# EAGLE design tigerV3s0-2 (EAGLE 9.6.2)
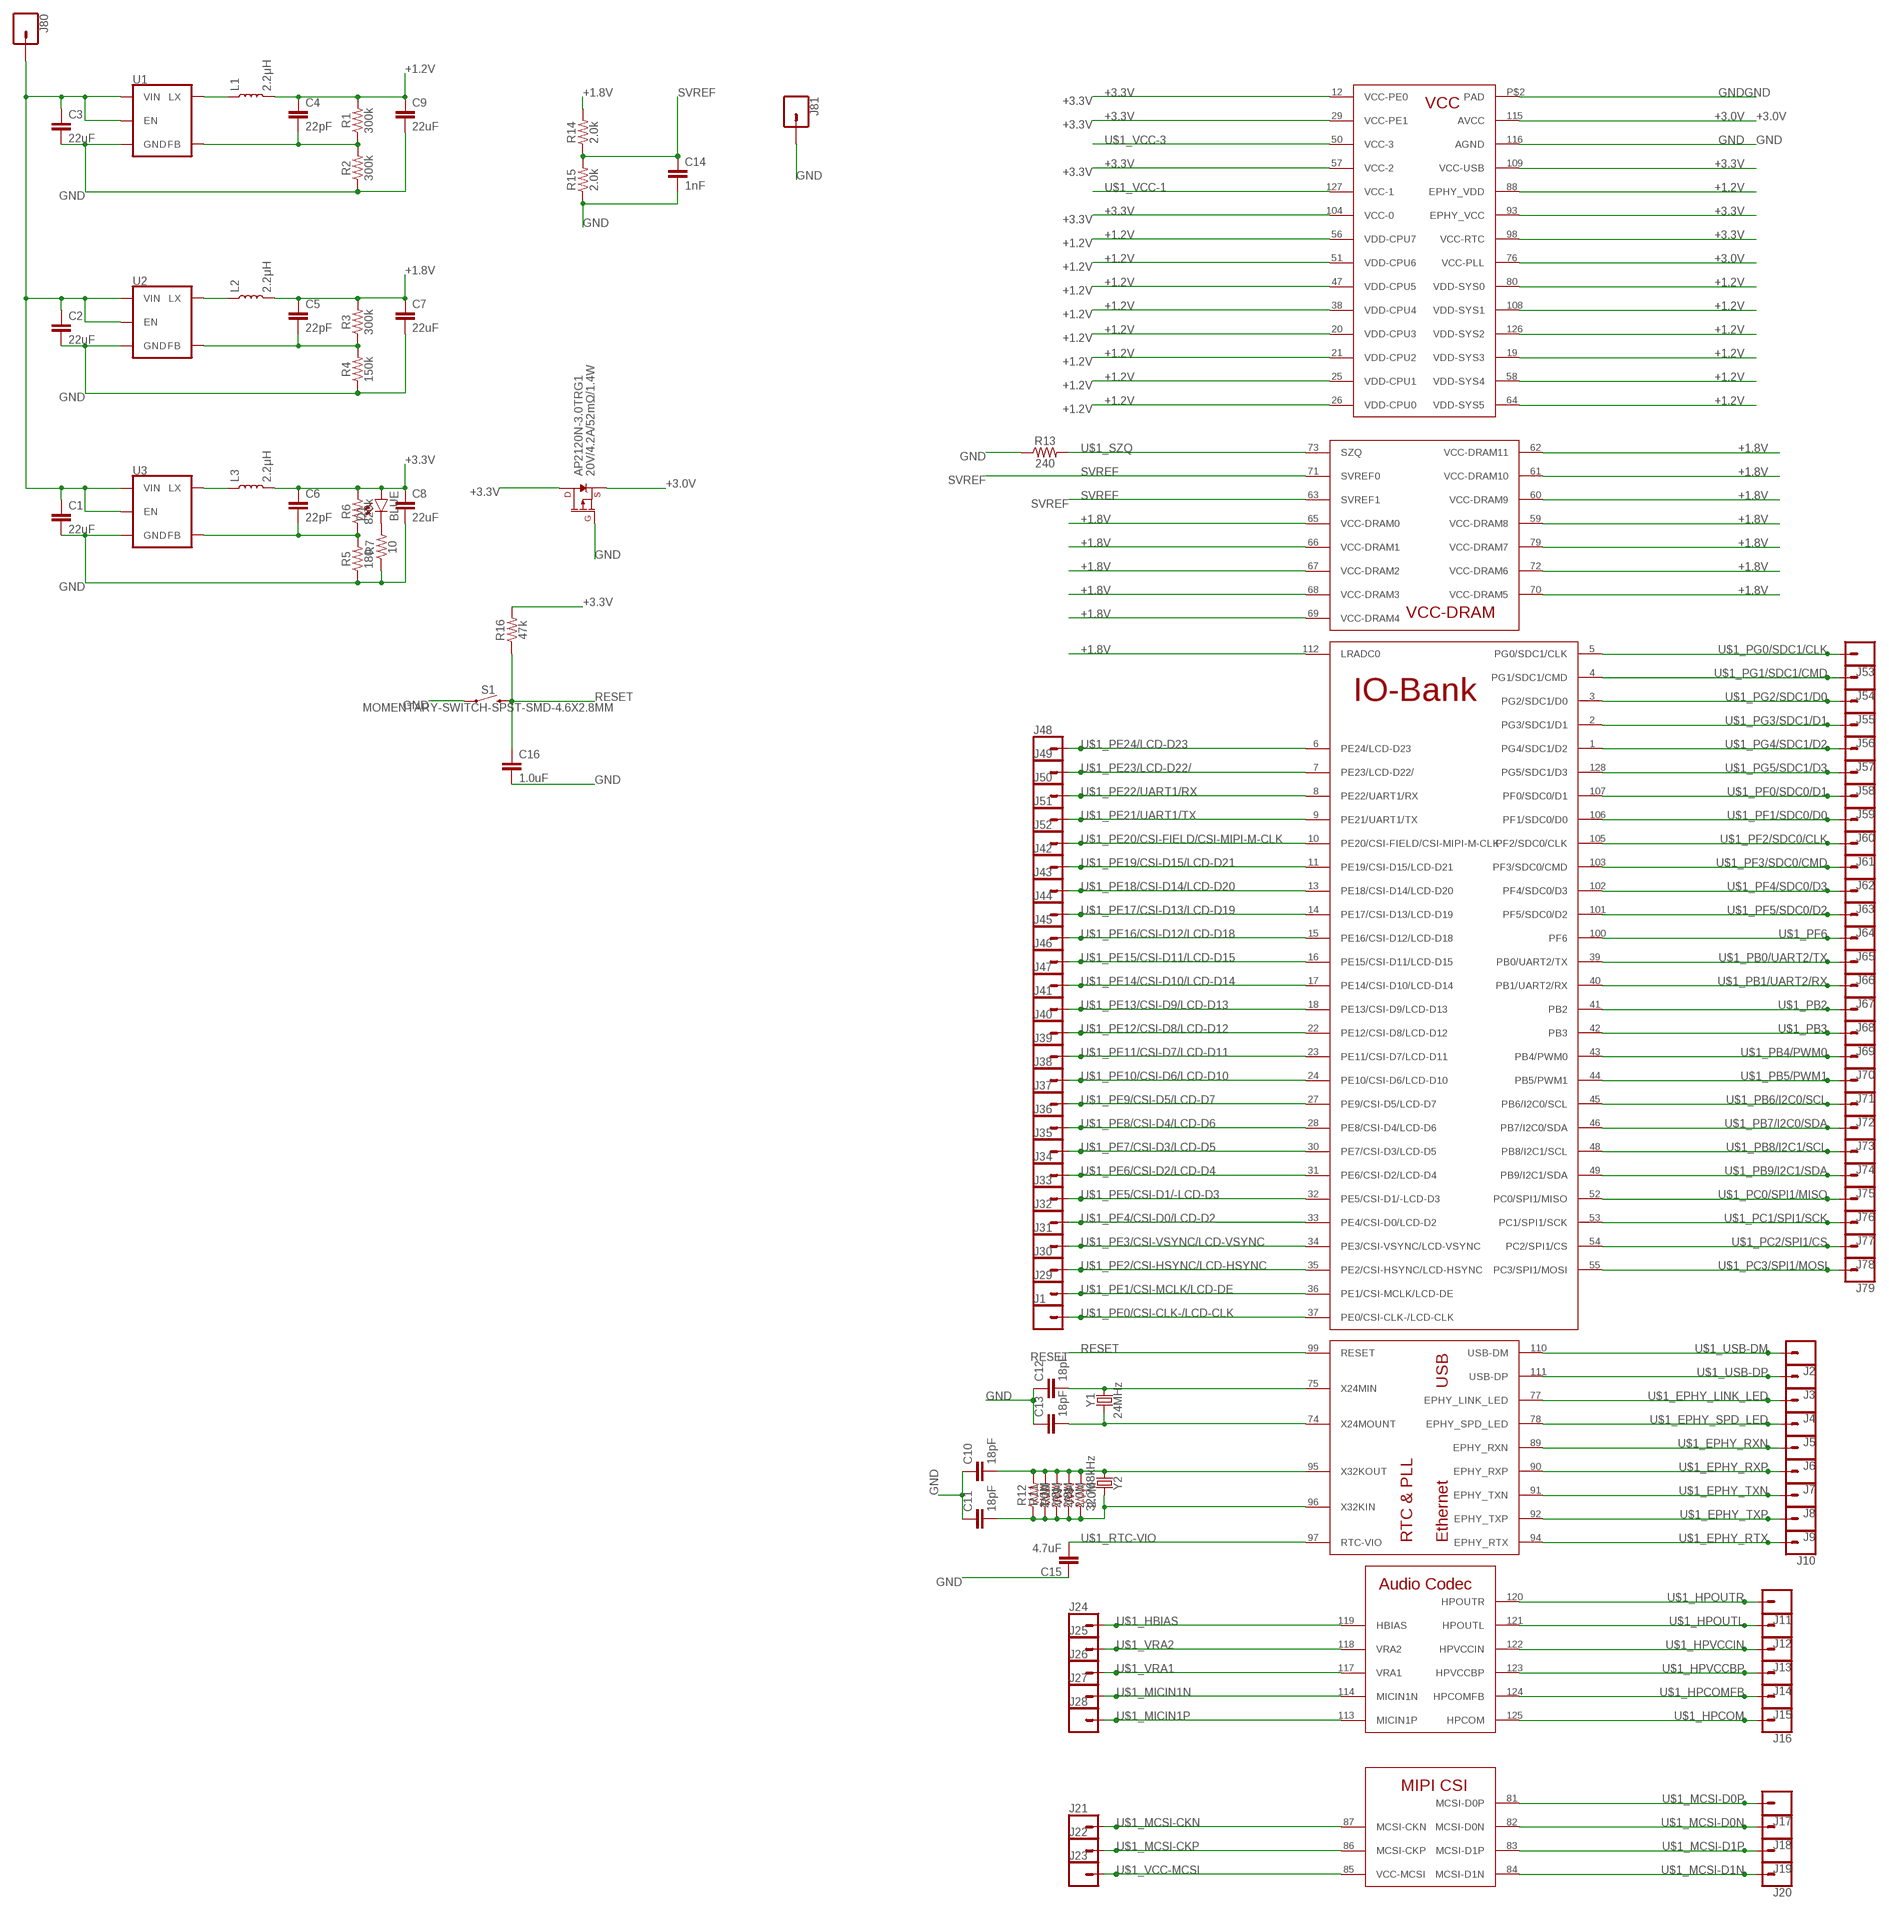
[diagram p0: schematic, sheet 1]

## Parts
AP2120N-3.0TRG1  20V/4.2A/52mΩ/1.4W  MOSFET_PCH-DMG2305UX-7  [SOT23-3]
C1  22uF  22UF-0805-6.3V-20%  [0805]
C2  22uF  22UF-0805-6.3V-20%  [0805]
C3  22uF  22UF-0805-6.3V-20%  [0805]
C4  22pF  22PF-0603-50V-5%  [0603]
C5  22pF  22PF-0603-50V-5%  [0603]
C6  22pF  22PF-0603-50V-5%  [0603]
C7  22uF  22UF-0805-6.3V-20%  [0805]
C8  22uF  22UF-0805-6.3V-20%  [0805]
C9  22uF  22UF-0805-6.3V-20%  [0805]
C10  18pF  18PF-0603-50V-5%  [0603]
C11  18pF  18PF-0603-50V-5%  [0603]
C12  18pF  18PF-0603-50V-5%  [0603]
C13  18pF  18PF-0603-50V-5%  [0603]
C14  1nF  1.0NF/1000PF-0603-50V-10%  [0603]
C15  4.7uF  4.7UF-0603-6.3V-(10%)  [0603]
C16  1.0uF  1.0UF-0603-16V-10%  [0603]
D1  BLUE  LED-BLUE0603  [LED-0603]
J1  CONN_01  [1X01]
J2  CONN_01  [1X01]
J3  CONN_01  [1X01]
J4  CONN_01  [1X01]
J5  CONN_01  [1X01]
J6  CONN_01  [1X01]
J7  CONN_01  [1X01]
J8  CONN_01  [1X01]
J9  CONN_01  [1X01]
J10  CONN_01  [1X01]
J11  CONN_01  [1X01]
J12  CONN_01  [1X01]
J13  CONN_01  [1X01]
J14  CONN_01  [1X01]
J15  CONN_01  [1X01]
J16  CONN_01  [1X01]
J17  CONN_01  [1X01]
J18  CONN_01  [1X01]
J19  CONN_01  [1X01]
J20  CONN_01  [1X01]
J21  CONN_01  [1X01]
J22  CONN_01  [1X01]
J23  CONN_01  [1X01]
J24  CONN_01  [1X01]
J25  CONN_01  [1X01]
J26  CONN_01  [1X01]
J27  CONN_01  [1X01]
J28  CONN_01  [1X01]
J29  CONN_01  [1X01]
J30  CONN_01  [1X01]
J31  CONN_01  [1X01]
J32  CONN_01  [1X01]
J33  CONN_01  [1X01]
J34  CONN_01  [1X01]
J35  CONN_01  [1X01]
J36  CONN_01  [1X01]
J37  CONN_01  [1X01]
J38  CONN_01  [1X01]
J39  CONN_01  [1X01]
J40  CONN_01  [1X01]
J41  CONN_01  [1X01]
J42  CONN_01  [1X01]
J43  CONN_01  [1X01]
J44  CONN_01  [1X01]
J45  CONN_01  [1X01]
J46  CONN_01  [1X01]
J47  CONN_01  [1X01]
J48  CONN_01  [1X01]
J49  CONN_01  [1X01]
J50  CONN_01  [1X01]
J51  CONN_01  [1X01]
J52  CONN_01  [1X01]
J53  CONN_01  [1X01]
J54  CONN_01  [1X01]
J55  CONN_01  [1X01]
J56  CONN_01  [1X01]
J57  CONN_01  [1X01]
J58  CONN_01  [1X01]
J59  CONN_01  [1X01]
J60  CONN_01  [1X01]
J61  CONN_01  [1X01]
J62  CONN_01  [1X01]
J63  CONN_01  [1X01]
J64  CONN_01  [1X01]
J65  CONN_01  [1X01]
J66  CONN_01  [1X01]
J67  CONN_01  [1X01]
J68  CONN_01  [1X01]
J69  CONN_01  [1X01]
J70  CONN_01  [1X01]
J71  CONN_01  [1X01]
J72  CONN_01  [1X01]
J73  CONN_01  [1X01]
J74  CONN_01  [1X01]
J75  CONN_01  [1X01]
J76  CONN_01  [1X01]
J77  CONN_01  [1X01]
J78  CONN_01  [1X01]
J79  CONN_01  [1X01]
J80  CONN_01  [1X01]
J81  CONN_01  [1X01]
L1  2.2μH  2.2μH-0805_WIDE-2.2μH-1.7A-0.14OHM  [0805-WIDE]
L2  2.2μH  2.2μH-0805_WIDE-2.2μH-1.7A-0.14OHM  [0805-WIDE]
L3  2.2μH  2.2μH-0805_WIDE-2.2μH-1.7A-0.14OHM  [0805-WIDE]
R1  300k  300KOHM-0603-1/10W-1%  [0603]
R2  300k  300KOHM-0603-1/10W-1%  [0603]
R3  300k  300KOHM-0603-1/10W-1%  [0603]
R4  150k  150KOHM-0603-1/10W-1%  [0603]
R5  180  180OHM-0603-1/10W-1%  [0603]
R6  820k  820KOHM-0603-1/10W-1%  [0603]
R7  10  10OHM-0603-1/10W-1%  [0603]
R8  2.0M  2MOHMS-0603-1/10W-1%  [0603]
R9  2.0M  2MOHMS-0603-1/10W-1%  [0603]
R10  2.0M  2MOHMS-0603-1/10W-1%  [0603]
R11  2.0M  2MOHMS-0603-1/10W-1%  [0603]
R12  2.0M  2MOHMS-0603-1/10W-1%  [0603]
R13  240  240OHM-0603-1/10W-1%  [0603]
R14  2.0k  2.0KOHM-0603-1/10W-5%  [0603]
R15  2.0k  2.0KOHM-0603-1/10W-5%  [0603]
R16  47k  47KOHM-0603-1/10W-1%  [0603]
S1  MOMENTARY-SWITCH-SPST-SMD-4.6X2.8MM  [TACTILE_SWITCH_SMD_4.6X2.8MM]
U1  AP3429/A  [SOT23-5]
U2  AP3429/A  [SOT23-5]
U3  AP3429/A  [SOT23-5]
U$1  V3S  [QFP-128]
Y1  24MHz  CRYSTAL-24MHZ-SMD-5.0X3.2MM  [CRYSTAL-SMD-5X3.2-4PAD]
Y2  32.768kHz  CRYSTAL-32.768KHZSMD-3.2X1.5  [CRYSTAL-SMD-3.2X1.5MM]

## Nets
+1.2V: C4.1 C9.1 L1.2 R1.2 U$1.19(VDD-SYS3) U$1.20(VDD-CPU3) U$1.21(VDD-CPU2) U$1.25(VDD-CPU1) U$1.26(VDD-CPU0) U$1.38(VDD-CPU4) U$1.47(VDD-CPU5) U$1.51(VDD-CPU6) U$1.56(VDD-CPU7) U$1.58(VDD-SYS4) U$1.64(VDD-SYS5) U$1.80(VDD-SYS0) U$1.88(EPHY_VDD) U$1.108(VDD-SYS1) U$1.126(VDD-SYS2)
+1.8V: C5.1 C7.1 L2.2 R3.2 R14.2 U$1.59(VCC-DRAM8) U$1.60(VCC-DRAM9) U$1.61(VCC-DRAM10) U$1.62(VCC-DRAM11) U$1.65(VCC-DRAM0) U$1.66(VCC-DRAM1) U$1.67(VCC-DRAM2) U$1.68(VCC-DRAM3) U$1.69(VCC-DRAM4) U$1.70(VCC-DRAM5) U$1.72(VCC-DRAM6) U$1.79(VCC-DRAM7) U$1.112(LRADC0)
+3.0V: AP2120N-3.0TRG1.2(S) U$1.76(VCC-PLL) U$1.115(AVCC)
+3.3V: AP2120N-3.0TRG1.3(D) C6.1 C8.1 D1.A L3.2 R6.2 R16.2 U$1.12(VCC-PE0) U$1.29(VCC-PE1) U$1.57(VCC-2) U$1.93(EPHY_VCC) U$1.98(VCC-RTC) U$1.104(VCC-0) U$1.109(VCC-USB)
+5V: C1.1 C2.1 C3.1 J80.1 U1.1(EN) U1.4(VIN) U2.1(EN) U2.4(VIN) U3.1(EN) U3.4(VIN)
GND: AP2120N-3.0TRG1.1(G) C1.2 C2.2 C3.2 C7.2 C8.2 C9.2 C10.1 C11.1 C12.1 C13.1 C14.2 C15.1 C16.2 J81.1 R2.1 R4.1 R5.1 R7.1 R13.1 R15.1 S1.1 S1.2 U1.2(GND) U2.2(GND) U3.2(GND) U$1.116(AGND) U$1.P$2(PAD)
N$1: L1.1 U1.3(LX)
N$2: D1.C R7.2
N$3: L2.1 U2.3(LX)
N$4: C13.2 U$1.74(X24MOUNT) Y1.1
N$5: L3.1 U3.3(LX)
N$6: C12.2 U$1.75(X24MIN) Y1.3
N$7: C6.2 R5.2 R6.1 U3.5(FB)
N$8: C5.2 R3.1 R4.2 U2.5(FB)
N$9: C4.2 R1.1 R2.2 U1.5(FB)
N$10: C10.2 R8.2 R9.2 R10.2 R11.2 R12.2 U$1.95(X32KOUT) Y2.P$1
N$11: C11.2 R8.1 R9.1 R10.1 R11.1 R12.1 U$1.96(X32KIN) Y2.P$2
RESET: C16.1 R16.1 S1.3 S1.4 U$1.99(RESET)
SVREF: C14.1 R14.1 R15.2 U$1.63(SVREF1) U$1.71(SVREF0)
U$1_EPHY_LINK_LED: J4.1 U$1.77(EPHY_LINK_LED)
U$1_EPHY_RTX: J10.1 U$1.94(EPHY_RTX)
U$1_EPHY_RXN: J6.1 U$1.89(EPHY_RXN)
U$1_EPHY_RXP: J7.1 U$1.90(EPHY_RXP)
U$1_EPHY_SPD_LED: J5.1 U$1.78(EPHY_SPD_LED)
U$1_EPHY_TXN: J8.1 U$1.91(EPHY_TXN)
U$1_EPHY_TXP: J9.1 U$1.92(EPHY_TXP)
U$1_HBIAS: J24.1 U$1.119(HBIAS)
U$1_HPCOM: J16.1 U$1.125(HPCOM)
U$1_HPCOMFB: J15.1 U$1.124(HPCOMFB)
U$1_HPOUTL: J12.1 U$1.121(HPOUTL)
U$1_HPOUTR: J11.1 U$1.120(HPOUTR)
U$1_HPVCCBP: J14.1 U$1.123(HPVCCBP)
U$1_HPVCCIN: J13.1 U$1.122(HPVCCIN)
U$1_MCSI-CKN: J21.1 U$1.87(MCSI-CKN)
U$1_MCSI-CKP: J22.1 U$1.86(MCSI-CKP)
U$1_MCSI-D0N: J18.1 U$1.82(MCSI-D0N)
U$1_MCSI-D0P: J17.1 U$1.81(MCSI-D0P)
U$1_MCSI-D1N: J20.1 U$1.84(MCSI-D1N)
U$1_MCSI-D1P: J19.1 U$1.83(MCSI-D1P)
U$1_MICIN1N: J27.1 U$1.114(MICIN1N)
U$1_MICIN1P: J28.1 U$1.113(MICIN1P)
U$1_PB0/UART2/TX: J66.1 U$1.39(PB0/UART2/TX)
U$1_PB1/UART2/RX: J67.1 U$1.40(PB1/UART2/RX)
U$1_PB2: J68.1 U$1.41(PB2)
U$1_PB3: J69.1 U$1.42(PB3)
U$1_PB4/PWM0: J70.1 U$1.43(PB4/PWM0)
U$1_PB5/PWM1: J71.1 U$1.44(PB5/PWM1)
U$1_PB6/I2C0/SCL: J72.1 U$1.45(PB6/I2C0/SCL)
U$1_PB7/I2C0/SDA: J73.1 U$1.46(PB7/I2C0/SDA)
U$1_PB8/I2C1/SCL: J74.1 U$1.48(PB8/I2C1/SCL)
U$1_PB9/I2C1/SDA: J75.1 U$1.49(PB9/I2C1/SDA)
U$1_PC0/SPI1/MISO: J76.1 U$1.52(PC0/SPI1/MISO)
U$1_PC1/SPI1/SCK: J77.1 U$1.53(PC1/SPI1/SCK)
U$1_PC2/SPI1/CS: J78.1 U$1.54(PC2/SPI1/CS)
U$1_PC3/SPI1/MOSI: J79.1 U$1.55(PC3/SPI1/MOSI)
U$1_PE0/CSI-CLK-/LCD-CLK: J1.1 U$1.37(PE0/CSI-CLK-/LCD-CLK)
U$1_PE1/CSI-MCLK/LCD-DE: J29.1 U$1.36(PE1/CSI-MCLK/LCD-DE)
U$1_PE2/CSI-HSYNC/LCD-HSYNC: J30.1 U$1.35(PE2/CSI-HSYNC/LCD-HSYNC)
U$1_PE3/CSI-VSYNC/LCD-VSYNC: J31.1 U$1.34(PE3/CSI-VSYNC/LCD-VSYNC)
U$1_PE4/CSI-D0/LCD-D2: J32.1 U$1.33(PE4/CSI-D0/LCD-D2)
U$1_PE5/CSI-D1/-LCD-D3: J33.1 U$1.32(PE5/CSI-D1/-LCD-D3)
U$1_PE6/CSI-D2/LCD-D4: J34.1 U$1.31(PE6/CSI-D2/LCD-D4)
U$1_PE7/CSI-D3/LCD-D5: J35.1 U$1.30(PE7/CSI-D3/LCD-D5)
U$1_PE8/CSI-D4/LCD-D6: J36.1 U$1.28(PE8/CSI-D4/LCD-D6)
U$1_PE9/CSI-D5/LCD-D7: J37.1 U$1.27(PE9/CSI-D5/LCD-D7)
U$1_PE10/CSI-D6/LCD-D10: J38.1 U$1.24(PE10/CSI-D6/LCD-D10)
U$1_PE11/CSI-D7/LCD-D11: J39.1 U$1.23(PE11/CSI-D7/LCD-D11)
U$1_PE12/CSI-D8/LCD-D12: J40.1 U$1.22(PE12/CSI-D8/LCD-D12)
U$1_PE13/CSI-D9/LCD-D13: J41.1 U$1.18(PE13/CSI-D9/LCD-D13)
U$1_PE14/CSI-D10/LCD-D14: J47.1 U$1.17(PE14/CSI-D10/LCD-D14)
U$1_PE15/CSI-D11/LCD-D15: J46.1 U$1.16(PE15/CSI-D11/LCD-D15)
U$1_PE16/CSI-D12/LCD-D18: J45.1 U$1.15(PE16/CSI-D12/LCD-D18)
U$1_PE17/CSI-D13/LCD-D19: J44.1 U$1.14(PE17/CSI-D13/LCD-D19)
U$1_PE18/CSI-D14/LCD-D20: J43.1 U$1.13(PE18/CSI-D14/LCD-D20)
U$1_PE19/CSI-D15/LCD-D21: J42.1 U$1.11(PE19/CSI-D15/LCD-D21)
U$1_PE20/CSI-FIELD/CSI-MIPI-M-CLK: J52.1 U$1.10(PE20/CSI-FIELD/CSI-MIPI-M-CLK)
U$1_PE21/UART1/TX: J51.1 U$1.9(PE21/UART1/TX)
U$1_PE22/UART1/RX: J50.1 U$1.8(PE22/UART1/RX)
U$1_PE23/LCD-D22/: J49.1 U$1.7(PE23/LCD-D22/)
U$1_PE24/LCD-D23: J48.1 U$1.6(PE24/LCD-D23)
U$1_PF0/SDC0/D1: J59.1 U$1.107(PF0/SDC0/D1)
U$1_PF1/SDC0/D0: J60.1 U$1.106(PF1/SDC0/D0)
U$1_PF2/SDC0/CLK: J61.1 U$1.105(PF2/SDC0/CLK)
U$1_PF3/SDC0/CMD: J62.1 U$1.103(PF3/SDC0/CMD)
U$1_PF4/SDC0/D3: J63.1 U$1.102(PF4/SDC0/D3)
U$1_PF5/SDC0/D2: J64.1 U$1.101(PF5/SDC0/D2)
U$1_PF6: J65.1 U$1.100(PF6)
U$1_PG0/SDC1/CLK: J53.1 U$1.5(PG0/SDC1/CLK)
U$1_PG1/SDC1/CMD: J54.1 U$1.4(PG1/SDC1/CMD)
U$1_PG2/SDC1/D0: J55.1 U$1.3(PG2/SDC1/D0)
U$1_PG3/SDC1/D1: J56.1 U$1.2(PG3/SDC1/D1)
U$1_PG4/SDC1/D2: J57.1 U$1.1(PG4/SDC1/D2)
U$1_PG5/SDC1/D3: J58.1 U$1.128(PG5/SDC1/D3)
U$1_RTC-VIO: C15.2 U$1.97(RTC-VIO)
U$1_SZQ: R13.2 U$1.73(SZQ)
U$1_USB-DM: J2.1 U$1.110(USB-DM)
U$1_USB-DP: J3.1 U$1.111(USB-DP)
U$1_VCC-1: U$1.127(VCC-1)
U$1_VCC-3: U$1.50(VCC-3)
U$1_VCC-MCSI: J23.1 U$1.85(VCC-MCSI)
U$1_VRA1: J26.1 U$1.117(VRA1)
U$1_VRA2: J25.1 U$1.118(VRA2)

## Library data of the parts
AP2120N-3.0TRG1 = SparkFun-DiscreteSemi:MOSFET_PCH: P-channel MOSFETs Voltage controlled devices that allow control of high current outputs. SparkFun Products: SparkFun ESP32 Thing <https://www.sparkfun.com/products/13907> SparkFun ESP8266 Thing <https://www.sparkfun.com/products/13231> SparkFun Pi Servo HAT V2 <https://www.sparkfun.com/products/15316> DMG2305UX-7 (20V/4.2A/SOT23-3); PROD_ID: TRAN-14388
C1-C3 C7-C9 = SparkFun-Capacitors:22UF: 22µF ceramic capacitors A capacitor is a passive two-terminal electrical component used to store electrical energy temporarily in an electric field.; PROD_ID: CAP-08402
C4-C6 = SparkFun-Capacitors:22PF: 22pF ceramic capacitors A capacitor is a passive two-terminal electrical component used to store electrical energy temporarily in an electric field.; PROD_ID: CAP-07876
C10-C13 = SparkFun-Capacitors:18PF: 18pF ceramic capacitors A capacitor is a passive two-terminal electrical component used to store electrical energy temporarily in an electric field.; PROD_ID: CAP-08267
C14 = SparkFun-Capacitors:1.0NF/1000PF: 1nF/1,000pF ceramic capacitors A capacitor is a passive two-terminal electrical component used to store electrical energy temporarily in an electric field.; PROD_ID: CAP-07886
C15 = SparkFun-Capacitors:4.7UF: 4.7µF ceramic capacitors A capacitor is a passive two-terminal electrical component used to store electrical energy temporarily in an electric field.; PROD_ID: CAP-08280
C16 = SparkFun-Capacitors:1.0UF: 1µF ceramic capacitors A capacitor is a passive two-terminal electrical component used to store electrical energy temporarily in an electric field.; PROD_ID: CAP-00868
D1 = SparkFun-LED:LED-BLUE: Blue SMD LED Used in manufacturing of various products at SparkFun Packages: 0603 - SMD 0603 package [Product Link] <http://www.digikey.com/product-detail/en/SMLE12BC7TT86/511-1589-2-ND/1641808> 1206 - SMD1206 package [Product Link] <http://www.digikey.com/product-detail/en/lite-on-inc/LTST-C150TBKT/160-1643-1-ND/573584> SparkFun Products: ESP8266 Thing-Dev Board <https://www.sparkfun.com/products/13711> RedBoard <https://www.sparkfun.com/products/12757>; PROD_ID: DIO-08575
J1-J81 = SparkFun-Connectors:CONN_01: Single connection point. Often used as Generic Header-pin footprint for 0.1 inch spaced/style header connections On any of the 0.1 inch spaced packages, you can populate with these: Break Away Headers - Straight <https://www.sparkfun.com/products/116> (PRT-00116) Break Away Male Headers - Right Angle <https://www.sparkfun.com/products/553> (PRT-00553) Female Headers <https://www.sparkfun.com/products/115> (PRT-00115) Break Away Headers - Machine Pin <https://www.sparkfun.com/products/117> (PRT-00117) Break Away Female Headers - Swiss Machine Pin <https://www.sparkfun.com/products/743> (PRT-00743) This device is also useful as a general connection point to wire up your design to another part of your project. Our various solder wires solder well into these plated through hole pads. Hook-Up Wire - Assortment (Stranded, 22 AWG) <https://www.sparkfun.com/products/11375> (PRT-11375) Hook-Up Wire - Assortment (Solid Core, 22 AWG) <https://www.sparkfun.com/products/11367> (PRT-11367) View the entire wire category on our website here <https://www.sparkfun.com/categories/141> Special notes: SMTSO-256-ET is a "flush mount" nut for a 4-40 screw. We mostly use this on specialty testbeds; it is a nice way to connect hardware to your PCB at an adjustable hieght. Also note, the SNAP packages are for using a snappable style connector. We sell a baggie of snaps and they are also used on two LilyPad designs: Snap Assortment - 30 pack (male and female) <https://www.sparkfun.com/products/11347> (DEV-11347) LilyPad Arduino SimpleSnap <https://www.sparkfun.com/products/10941> (DEV-10941) LilyPad SimpleSnap Protoboard <https://www.sparkfun.com/products/10940> (DEV-10940)
L1-L3 = SparkFun-Coils:2.2μH: 2.2μH Inductor Resist changes in electrical current. Basically a coil of wire. SparkFun Products: SparkFun Edge - HX711 <https://www.sparkfun.com/products/15170>; PROD_ID: NDUC-14234
R1-R3 = SparkFun-Resistors:300KOHM: 300kΩ resistor A resistor is a passive two-terminal electrical component that implements electrical resistance as a circuit element. Resistors act to reduce current flow, and, at the same time, act to lower voltage levels within circuits. - Wikipedia; PROD_ID: RES-10809
R4 = SparkFun-Resistors:150KOHM: 150kΩ resistor A resistor is a passive two-terminal electrical component that implements electrical resistance as a circuit element. Resistors act to reduce current flow, and, at the same time, act to lower voltage levels within circuits. - Wikipedia; PROD_ID: RES-09117
R5 = SparkFun-Resistors:180OHM: 180Ω resistor A resistor is a passive two-terminal electrical component that implements electrical resistance as a circuit element. Resistors act to reduce current flow, and, at the same time, act to lower voltage levels within circuits. - Wikipedia; PROD_ID: RES-08788
R6 = SparkFun-Resistors:820KOHM: 820kΩ resistor A resistor is a passive two-terminal electrical component that implements electrical resistance as a circuit element. Resistors act to reduce current flow, and, at the same time, act to lower voltage levels within circuits. - Wikipedia; PROD_ID: RES-13247
R7 = SparkFun-Resistors:10OHM: 10Ω resistor A resistor is a passive two-terminal electrical component that implements electrical resistance as a circuit element. Resistors act to reduce current flow, and, at the same time, act to lower voltage levels within circuits. - Wikipedia; PROD_ID: RES-12581
R8-R12 = SparkFun-Resistors:2MOHMS: 2MΩ resistor A resistor is a passive two-terminal electrical component that implements electrical resistance as a circuit element. Resistors act to reduce current flow, and, at the same time, act to lower voltage levels within circuits. - Wikipedia; PROD_ID: RES-10054
R13 = SparkFun-Resistors:240OHM: 240Ω resistor A resistor is a passive two-terminal electrical component that implements electrical resistance as a circuit element. Resistors act to reduce current flow, and, at the same time, act to lower voltage levels within circuits. - Wikipedia; PROD_ID: RES-07849
R14 R15 = SparkFun-Resistors:2.0KOHM: 2kΩ resistor A resistor is a passive two-terminal electrical component that implements electrical resistance as a circuit element. Resistors act to reduce current flow, and, at the same time, act to lower voltage levels within circuits. - Wikipedia; PROD_ID: RES-08296
R16 = SparkFun-Resistors:47KOHM: 47kΩ resistor A resistor is a passive two-terminal electrical component that implements electrical resistance as a circuit element. Resistors act to reduce current flow, and, at the same time, act to lower voltage levels within circuits. - Wikipedia; PROD_ID: RES-07871
S1 = SparkFun-Switches:MOMENTARY-SWITCH-SPST: Momentary Switch (Pushbutton) - SPST Normally-open (NO) SPST momentary switches (buttons, pushbuttons). Variants PTH-12MM - 12mm square, through-hole Momentary Pushbutton Switch - 12mm Square <https://www.sparkfun.com/products/9190> (COM-09190) PTH-6.0MM, PTH-6.0MM-KIT - 6.0mm square, through-hole Mini Pushbutton Switch <https://www.sparkfun.com/products/97> (COM-00097) KIT package intended for soldering kit's - only one side of pads' copper is exposed. PTH-RIGHT-ANGLE-KIT - Right-angle, through-hole Right Angle Tactile Button <https://www.sparkfun.com/products/10791> - Used on SparkFun BigTime Watch Kit <https://www.sparkfun.com/products/11734> SMD-12MM - 12mm square, surface-mount Tactile Button - SMD (12mm) <https://www.sparkfun.com/products/12993> (COM-12993) Used on SparkFun PicoBoard <https://www.sparkfun.com/products/11888> SMD-4.5MM - 4.5mm Square Trackball Switch Used on SparkFun Blackberry Trackballer Breakout <https://www.sparkfun.com/products/13169> SMD-4.6MMX2.8MM - 4.60mm x 2.80mm, surface mount Used on SparkFun SAMD21 Mini Breakout <https://www.sparkfun.com/products/13664> SMD-5.2MM, SMD-5.2-REDUNDANT - 5.2mm square, surface-mount Mini Pushbutton Switch - SMD <https://www.sparkfun.com/products/8720> (COM-08720) Used on Arduino Pro Mini <https://www.sparkfun.com/products/11114> REDUNDANT package connects both switch circuits together SMD-6.0X3.5MM - 6.0 x 3.5mm, surface mount Momentary Reset Switch SMD <https://www.sparkfun.com/products/8229> (COM-08229) SMD-6.2MM-TALL - 6.2mm square, surface mount Tactile Button - SMD (6mm) <https://www.sparkfun.com/products/12992> Used on SparkFun Digital Sandbox <https://www.sparkfun.com/products/12651> SMD-RIGHT-ANGLE - Right-angle, surface mount Used on SparkFun Block for Intel® Edison - Arduino <https://www.sparkfun.com/products/13036>; PROD_ID: SWCH-13065
U1-U3 = SparkFun-IC-Power:AP3429/A: AP3429A DC adjustable buck up to 2A output. Auto cut-off at 2.7V makes this a good option for LiPo and other battery powered circuits.; PROD_ID: IC-14465
U$1 = allwinnerV3s:V3S
Y1 = SparkFun-Clocks:CRYSTAL-24MHZ: 24MHz Crystal Datasheet <http://www.sparkfun.com/datasheets/Components/AT-SMD-5x3.pdf> Frequency: 24MHz Frequency Tolerance: ±20ppm Load Capacitance: 12pF SparkFun Products: USB Bit Whacker <https://www.sparkfun.com/products/762>; PROD_ID: XTAL-08298; SF_ID: COM-08581
Y2 = SparkFun-Clocks:CRYSTAL-32.768KHZ: 32.768kHz Crystal Frequency: 32.768kHz Frequency Stability: ±20ppm Load Capacitance: 12.5pF (PTH-2X6 & SMD-3.2X1.5), 6pF (SMD-2X6) SparkFun Products: SparkFun BigTime Watch Kit <https://www.sparkfun.com/products/11734> SparkFun nRF52832 Breakout <https://www.sparkfun.com/products/13990> SparkFun Real Time Clock Module <https://www.sparkfun.com/products/12708>; PROD_ID: XTAL-13062

## Board
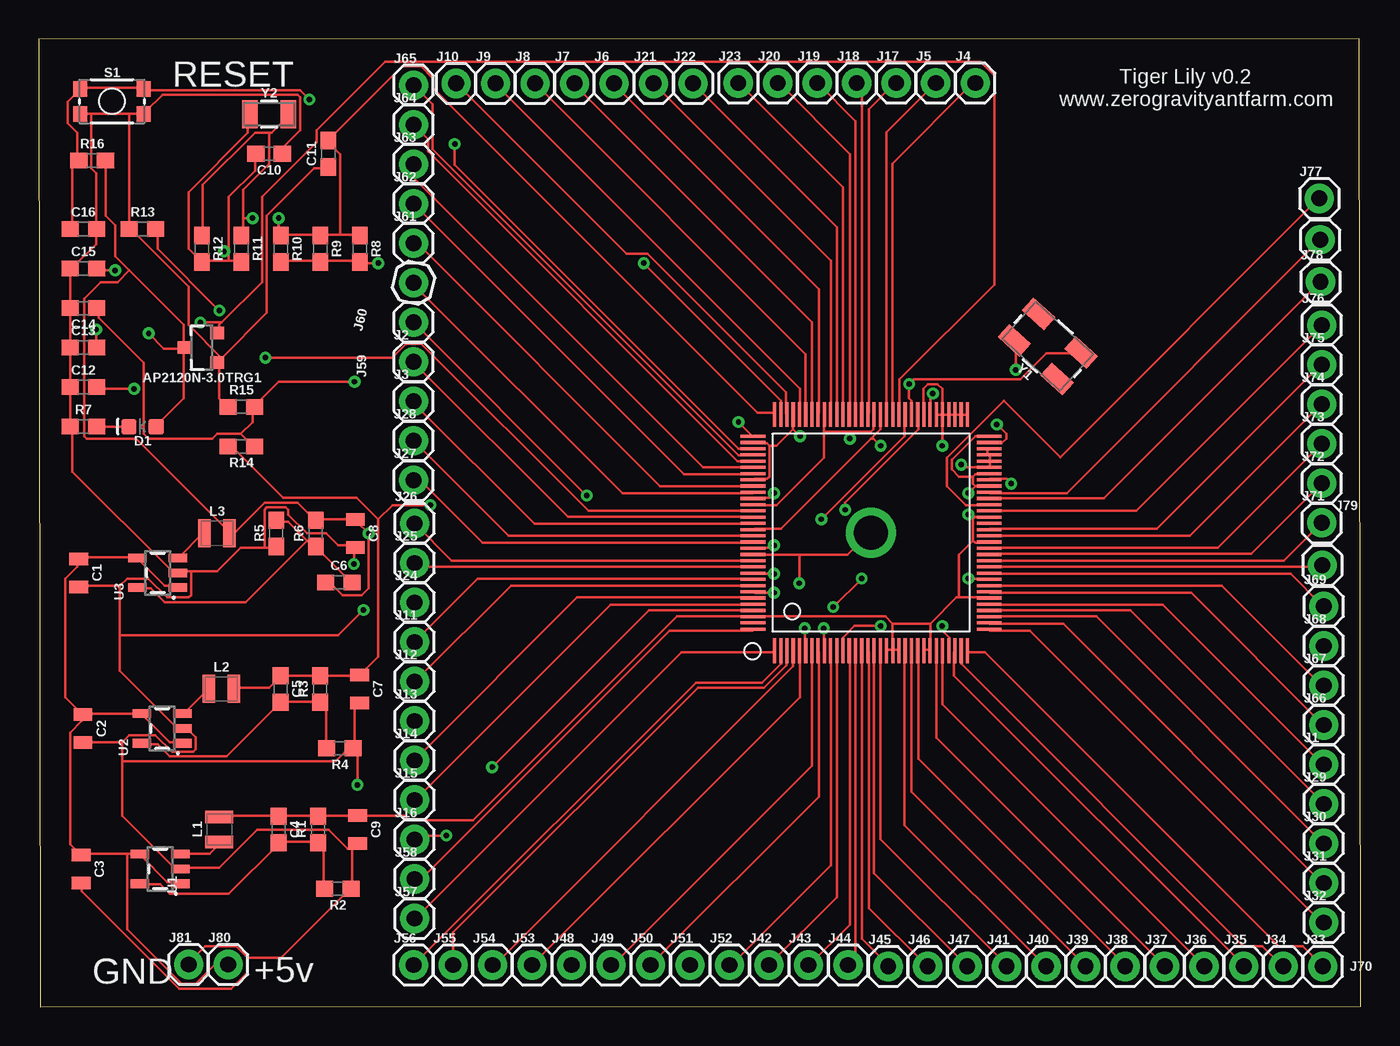
[diagram p1: board, top side]
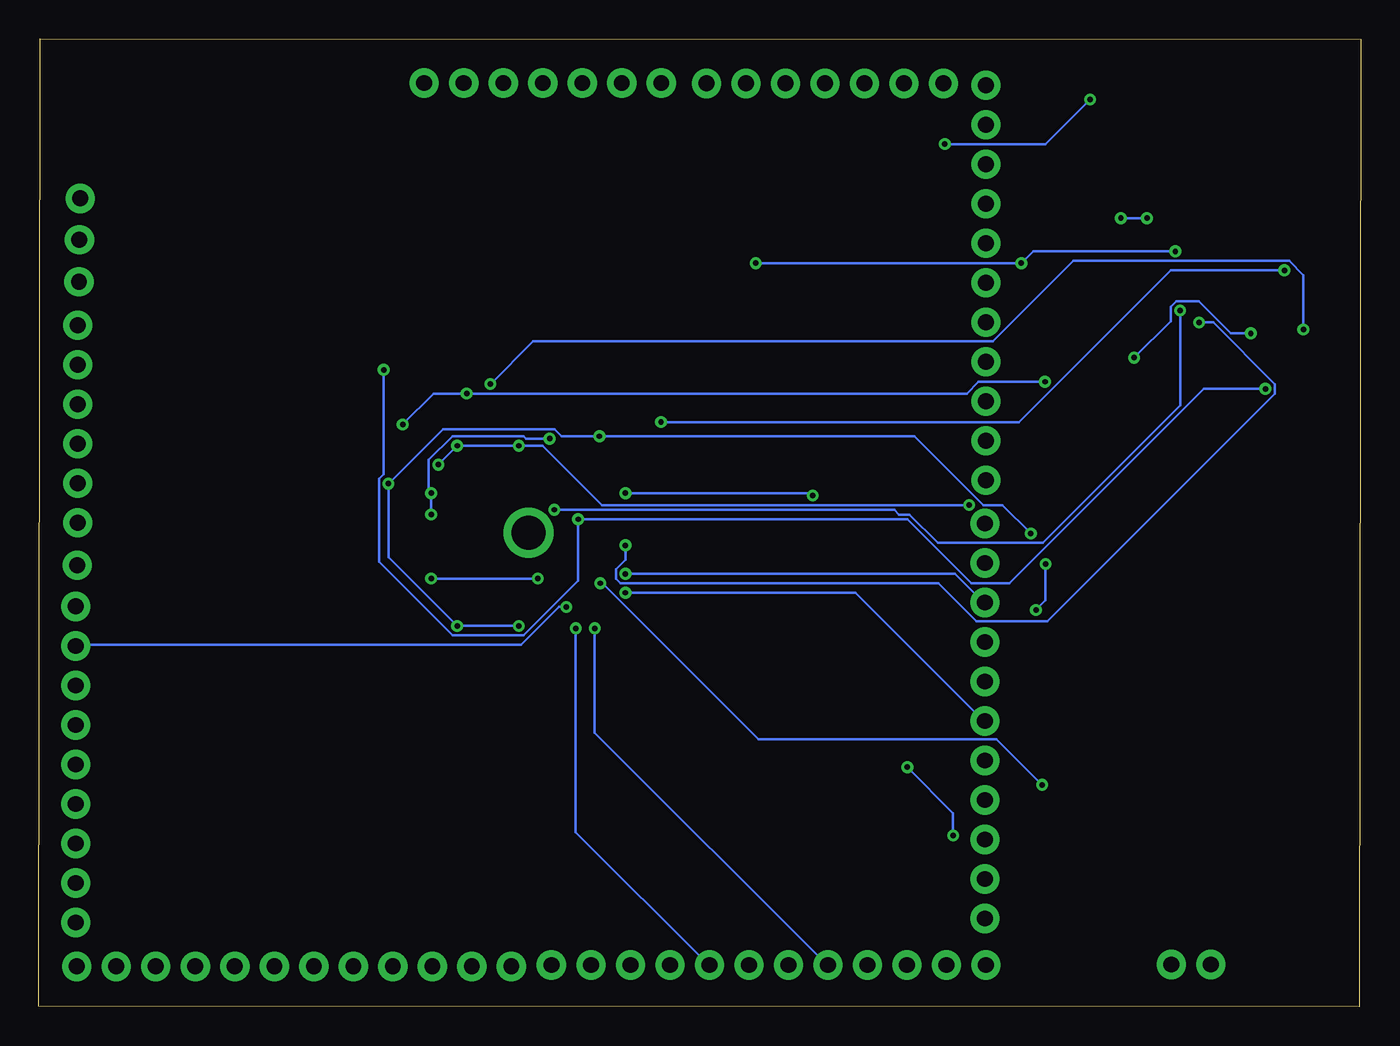
[diagram p2: board, bottom side, seen from below]

Size 84.99 x 62.21 mm. Coordinates in mm from the lower left corner, seen from the top.
Outline: 0.08,0 84.99,0.01 84.91,62.21 0,62.19 0.08,0
Copper layers (1*16): Top 0.035mm / dielectric 1.5mm / Bottom 0.035mm
Design rules "default": minimum track width 6mil, minimum drill 0.35mm, track to track 6mil, track to pad 6mil, pad to pad 6mil, via to via 6mil, smd to smd 6mil, copper to edge 40mil, drill to drill 6mil, minimum pad ring 10mil, minimum via ring 8mil, stop-mask expansion 4mil, vias tented up to drill 0mil, thermal gap 10mil

### Footprints (pad centres in the part's own frame; a part is rotated, then mirrored left to right if it is on the bottom)
SOT23-3 = smd 0.8 x 0.9: 1 -0.95,-1; 2 0.95,-1; 3 0,1.1
0805 = smd 0.8 x 1.2: 1 -0.9,0; 2 0.9,0
0603 = smd 1.1 x 1: 1 -0.85,0; 2 0.85,0
LED-0603 = smd 1 x 1: A -0.877,0; C 0.877,0
1X01 = drill 1.016 pad 1.88: 1 0,0
0805-WIDE = smd 0.8 x 1.8: 1 -0.8,0; 2 0.8,0
TACTILE_SWITCH_SMD_4.6X2.8MM = smd 0.9 x 1: 1 -2.05,-0.8; 2 2.05,-0.8; 3 2.05,0.8; 4 -2.05,0.8
SOT23-5 = smd 0.55 x 1.2: 1 -0.95,-1.3; 2 0,-1.3; 3 0.95,-1.3; 4 0.95,1.3; 5 -0.95,1.3
QFP-128 = smd 0.2 x 1.6: 1 -6.2,-7.6; 2 -5.8,-7.6; 3 -5.4,-7.6; 4 -5,-7.6; 5 -4.6,-7.6; 6 -4.2,-7.6; 7 -3.8,-7.6; 8 -3.4,-7.6; 9 -3,-7.6; 10 -2.6,-7.6; 11 -2.2,-7.6; 12 -1.8,-7.6; 13 -1.4,-7.6; 14 -1,-7.6; 15 -0.6,-7.6; 16 -0.2,-7.6; 17 0.2,-7.6; 18 0.6,-7.6; 19 1,-7.6; 20 1.4,-7.6; 21 1.8,-7.6; 22 2.2,-7.6; 23 2.6,-7.6; 24 3,-7.6; 25 3.4,-7.6; 26 3.8,-7.6; 27 4.2,-7.6; 28 4.6,-7.6; 29 5,-7.6; 30 5.4,-7.6; 31 5.8,-7.6; 32 6.2,-7.6; 65 6.2,7.6; 66 5.8,7.6; 67 5.4,7.6; 68 5,7.6; 69 4.6,7.6; 70 4.2,7.6; 71 3.8,7.6; 72 3.4,7.6; 73 3,7.6; 74 2.6,7.6; 75 2.2,7.6; 76 1.8,7.6; 77 1.4,7.6; 78 1,7.6; 79 0.6,7.6; 80 0.2,7.6; 81 -0.2,7.6; 82 -0.6,7.6; 83 -1,7.6; 84 -1.4,7.6; 85 -1.8,7.6; 86 -2.2,7.6; 87 -2.6,7.6; 88 -3,7.6; 89 -3.4,7.6; 90 -3.8,7.6; 91 -4.2,7.6; 92 -4.6,7.6; 93 -5,7.6; 94 -5.4,7.6; 95 -5.8,7.6; 96 -6.2,7.6 | smd 1.6 x 0.2: 33 7.6,-6.2; 34 7.6,-5.8; 35 7.6,-5.4; 36 7.6,-5; 37 7.6,-4.6; 38 7.6,-4.2; 39 7.6,-3.8; 40 7.6,-3.4; 41 7.6,-3; 42 7.6,-2.6; 43 7.6,-2.2; 44 7.6,-1.8; 45 7.6,-1.4; 46 7.6,-1; 47 7.6,-0.6; 48 7.6,-0.2; 49 7.6,0.2; 50 7.6,0.6; 51 7.6,1; 52 7.6,1.4; 53 7.6,1.8; 54 7.6,2.2; 55 7.6,2.6; 56 7.6,3; 57 7.6,3.4; 58 7.6,3.8; 59 7.6,4.2; 60 7.6,4.6; 61 7.6,5; 62 7.6,5.4; 63 7.6,5.8; 64 7.6,6.2; 97 -7.6,6.2; 98 -7.6,5.8; 99 -7.6,5.4; 100 -7.6,5; 101 -7.6,4.6; 102 -7.6,4.2; 103 -7.6,3.8; 104 -7.6,3.4; 105 -7.6,3; 106 -7.6,2.6; 107 -7.6,2.2; 108 -7.6,1.8; 109 -7.6,1.4; 110 -7.6,1; 111 -7.6,0.6; 112 -7.6,0.2; 113 -7.6,-0.2; 114 -7.6,-0.6; 115 -7.6,-1; 116 -7.6,-1.4; 117 -7.6,-1.8; 118 -7.6,-2.2; 119 -7.6,-2.6; 120 -7.6,-3; 121 -7.6,-3.4; 122 -7.6,-3.8; 123 -7.6,-4.2; 124 -7.6,-4.6; 125 -7.6,-5; 126 -7.6,-5.4; 127 -7.6,-5.8; 128 -7.6,-6.2 | drill 2.2: P$2 0,0
CRYSTAL-SMD-5X3.2-4PAD = smd 1.9 x 1.1: 1 -1.85,-1.15; 2 1.85,-1.15; 3 1.85,1.15; 4 -1.85,1.15
CRYSTAL-SMD-3.2X1.5MM = smd 1 x 1.8: P$1 -1.25,0; P$2 1.25,0

### Placement (x,y rotation side)
AP2120N-3.0TRG1  10.48,42.37 90 top
C1  2.57,27.89 270 top
C2  2.84,17.88 270 top
C3  2.72,8.85 270 top
C4  15.42,11.39 270 top
C5  15.54,20.42 270 top
C6  19.29,27.27 0 top
C7  20.62,20.42 270 top
C8  20.35,30.43 270 top
C9  20.5,11.39 270 top
C10  14.81,54.83 180 top
C11  18.62,54.83 90 top
C12  2.86,39.83 0 top
C13  2.86,42.37 0 top
C14  2.86,44.91 180 top
C15  2.86,47.45 0 top
C16  2.86,49.99 0 top
D1  6.67,37.29 180 top
J1  82.61,15.57 0 top
J2  24.09,41.45 0 top
J3  24.09,38.91 0 top
J4  60.21,59.37 0 top
J5  57.67,59.37 0 top
J6  36.98,59.35 0 top
J7  34.44,59.35 0 top
J8  31.9,59.35 0 top
J9  29.36,59.35 0 top
J10  26.82,59.35 0 top
J11  24.16,23.44 0 top
J12  24.16,20.9 0 top
J13  24.16,18.36 0 top
J14  24.16,15.82 0 top
J15  24.16,13.28 0 top
J16  24.16,10.74 0 top
J17  55.13,59.37 0 top
J18  52.59,59.37 0 top
J19  50.05,59.37 0 top
J20  47.51,59.37 0 top
J21  39.52,59.35 0 top
J22  42.06,59.35 0 top
J23  44.97,59.37 0 top
J24  24.16,25.98 0 top
J25  24.16,28.52 0 top
J26  24.16,31.06 0 top
J27  24.09,33.83 0 top
J28  24.09,36.37 0 top
J29  82.61,13.03 0 top
J30  82.61,10.49 0 top
J31  82.61,7.95 0 top
J32  82.61,5.41 0 top
J33  82.55,2.59 0 top
J34  80.01,2.59 0 top
J35  77.47,2.59 0 top
J36  74.93,2.59 0 top
J37  72.39,2.59 0 top
J38  69.85,2.59 0 top
J39  67.31,2.59 0 top
J40  64.77,2.59 0 top
J41  62.23,2.59 0 top
J42  46.95,2.68 0 top
J43  49.49,2.68 0 top
J44  52.03,2.68 0 top
J45  54.61,2.59 0 top
J46  57.15,2.59 0 top
J47  59.69,2.59 0 top
J48  34.25,2.68 0 top
J49  36.79,2.68 0 top
J50  39.33,2.68 0 top
J51  41.87,2.68 0 top
J52  44.41,2.68 0 top
J53  31.71,2.68 0 top
J54  29.17,2.68 0 top
J55  26.63,2.68 0 top
J56  24.09,2.68 0 top
J57  24.16,5.66 0 top
J58  24.16,8.2 0 top
J59  24.09,43.99 90 top
J60  24.09,46.53 75.9 top
J61  24.09,49.07 0 top
J62  24.09,51.61 0 top
J63  24.09,54.15 0 top
J64  24.09,56.69 0 top
J65  24.09,59.23 0 top
J66  82.61,18.11 0 top
J67  82.61,20.65 0 top
J68  82.61,23.19 0 top
J69  82.61,25.73 0 top
J70  82.52,28.37 0 top
J71  82.49,31.1 0 top
J72  82.49,33.64 0 top
J73  82.49,36.18 0 top
J74  82.49,38.72 0 top
J75  82.49,41.26 0 top
J76  82.49,43.8 0 top
J77  82.33,51.96 0 top
J78  82.41,46.6 0 top
J79  82.38,49.29 0 top
J80  12.17,2.72 0 top
J81  9.63,2.72 0 top
L1  11.61,11.39 90 top
L2  11.73,20.42 0 top
L3  11.46,30.43 0 top
R1  17.96,11.39 90 top
R2  19.23,7.58 180 top
R3  18.08,20.42 90 top
R4  19.35,16.61 180 top
R5  15.27,30.43 90 top
R6  17.81,30.43 90 top
R7  2.86,37.29 0 top
R8  20.64,48.72 270 top
R9  18.1,48.72 270 top
R10  15.56,48.72 270 top
R11  13.02,48.72 270 top
R12  10.48,48.72 270 top
R13  6.67,49.99 0 top
R14  13.02,36.02 180 top
R15  13.02,38.56 0 top
R16  3.43,54.38 0 top
S1  4.7,58.19 0 top
U1  7.8,8.85 90 top
U2  7.92,17.88 90 top
U3  7.65,27.89 90 top
U$1  53.51,30.47 0 top
Y1  64.87,42.44 137.8 top
Y2  14.81,57.37 0 top

### Tracks (layer width: path | path; a pad name or v marks a point on that pad's centre or on a via)
+1.2V  (via drill 0.35)
  Top 0.152: 50.47,36.97 50.47,38.04 U$1.88 | 50.47,36.97 50.47,35.29 47.42,32.24 46.05,32.24 U$1.108 | 50.47,36.97 52.15,36.97 | 52.15,36.97 53.52,36.97 53.67,37.12 53.67,38.04 U$1.80 | 60.22,33.46 60.99,33.46 U$1.56 | 60.22,33.46 60.07,33.62 60.07,34.07 | 60.07,34.07 60.22,34.23 60.99,34.23 U$1.58 | 60.07,34.07 59.16,34.07 58.7,34.53 58.7,35.14 60.22,36.66 60.99,36.66 U$1.64 | 60.07,29.96 60.22,29.81 60.99,29.81 U$1.47 | 60.07,31.33 60.07,29.96 | 60.07,31.33 60.22,31.48 60.99,31.48 U$1.51 | 57.33,22.95 56.87,22.95 U$1.25 | 59.16,26.3 59,26.3 57.33,24.62 | 59.16,26.3 60.99,26.3 U$1.38 | 57.33,22.95 57.33,24.62 | 57.33,22.95 U$1.26 | 60.07,29.96 59.16,29.04 59.16,26.3 | v59.77,33.01 60.22,33.46 | 60.07,31.33 v59.77,31.64 | v52.15,36.51 52.15,36.97 | 15.42,12.28 17.86,12.28 R1.2 18.01,12.28 20.45,12.28 C9.1 20.6,12.28 23.49,12.28 23.8,11.98 27.91,11.98 41.02,25.08 45.9,25.08 U$1.126 46.05,25.08 54.43,25.08 54.89,24.62 | 15.42,12.28 11.61,12.28 L1.2 | 15.42,12.28 C4.1 | 54.89,22.95 54.89,24.62 | 54.89,22.95 54.58,22.95 U$1.19 | 54.89,22.95 55.35,22.95 U$1.21 | 54.89,22.95 U$1.20 | 54.89,24.62 57.33,24.62
  Bottom 0.152: v59.77,31.64 v59.77,33.01 59.92,33.16 59.92,35.14 58.39,36.66 53.82,36.66 53.67,36.51 v52.15,36.51
+1.8V  (via drill 0.35)
  Top 0.152: U$1.62 60.99,35.9 60.99,35.45 U$1.61 61.14,35.45 61.14,35.14 U$1.60 61.14,34.99 61.14,34.68 U$1.59 60.99,34.68 59.46,34.68 v59.31,34.84 | 58.55,38.04 58.85,38.04 U$1.67 59,38.04 59.31,38.04 | 59.31,38.04 59.61,38.04 U$1.65 | 59.31,38.04 U$1.66 | U$1.72 56.87,38.19 56.87,39.71 57.18,40.02 57.78,40.02 58.09,39.71 58.09,38.19 U$1.69 58.09,38.04 | 58.09,38.04 57.78,38.04 U$1.70 | 58.09,38.04 58.55,38.04 | 58.55,38.04 U$1.68 | 58.09,38.04 v58.09,36.05 | 53.52,36.51 54.13,37.12 54.13,38.04 U$1.79 | 53.52,36.51 47.73,30.72 46.05,30.72 U$1.112 | v54.13,36.05 53.67,36.51 53.52,36.51 | L2.2 12.67,20.51 14.81,20.51 15.42,21.12 C5.1 15.57,21.27 18.01,21.27 R3.2 18.16,21.27 20.6,21.27 C7.1 20.75,21.42 21.82,22.49 21.82,31.33 | 21.82,31.33 20.45,32.7 15.72,32.7 12.52,35.9 12.22,35.9 R14.2 | v25.17,32.24 22.73,32.24 21.82,31.33
  Bottom 0.152: v59.31,34.84 v58.09,36.05 v54.13,36.05 52.6,36.05 48.79,32.24 v25.17,32.24
+3.0V  (via drill 0.35)
  Top 0.152: 11.76,43.98 14.35,46.57 14.35,52.06 17.86,55.56 17.86,56.32 22.28,60.74 60.53,60.74 61.44,59.83 61.44,46.42 55.35,40.32 55.35,38.19 U$1.76 | 11.76,43.98 11.61,43.83 11.61,43.37 AP2120N-3.0TRG1.2 | v47.27,29.65 47.12,29.5 46.05,29.5 U$1.115 | 11.76,43.98 v10.39,43.98
  Bottom 0.152: v47.27,29.65 47.27,28.74 47.88,28.13 47.88,27.52 47.57,27.22 27.15,27.22 24.71,24.78 20.14,24.78 5.51,39.41 5.51,40.02 9.47,43.98 v10.39,43.98
+3.3V  (via drill 0.35)
  Top 0.152: 46.96,36.05 46.96,34.07 46.81,33.92 46.05,33.92 U$1.104 | 46.96,36.05 46.81,36.21 46.05,36.21 U$1.98 | 48.49,37.12 48.49,38.04 U$1.93 | 48.49,37.12 47.42,36.05 46.96,36.05 | v54.13,24.47 52.45,24.47 51.69,23.71 51.69,22.95 U$1.12 | v58.09,24.47 58.09,24.17 58.55,23.71 58.55,22.95 U$1.29 | v62.51,33.62 62.2,33.92 61.14,33.92 U$1.57 | v48.95,36.66 48.49,37.12 | C6.1 18.47,27.22 18.77,27.22 19.53,26.45 20.75,26.45 21.21,26.91 v21.21,30.42 20.45,31.18 C8.1 20.29,31.33 17.86,31.33 R6.2 17.7,31.33 16.64,32.4 14.5,32.4 12.67,30.57 12.37,30.57 L3.2 12.22,30.57 6.27,36.51 3.07,36.51 2.92,36.66 2.92,45.5 3.99,46.57 5.05,46.57 5.82,47.33 | 9.32,42.3 9.32,39.1 7.65,37.43 D1.A | 9.32,42.3 AP2120N-3.0TRG1.3 9.32,42.46 9.32,43.83 5.82,47.33 | 5.82,47.33 4.9,48.25 4.9,50.23 4.29,50.84 4.29,54.34 R16.2 | U$1.109 35.33,31.87 24.58,42.62 23.61,42.62 22.71,41.72 v14.57,41.72 | v7.06,43.28 8.04,42.3 9.32,42.3
  Bottom 0.152: v54.13,24.47 v58.09,24.47 62.51,28.89 v62.51,33.62 59,37.12 51.84,37.12 51.38,36.66 v48.95,36.66 28.68,36.66 24.26,32.24 23.04,32.24 v21.21,30.42 | v7.06,43.28 8.34,43.28 10.41,45.35 11.86,45.35 12.21,44.99 12.21,44.07 v14.57,41.72
+5V
  Top 0.152: U3.1 8.86,27.06 8.1,27.06 6.43,28.74 U3.4 6.27,28.89 2.62,28.89 C1.1 2.46,28.74 2.46,28.28 1.7,27.52 1.7,19.9 2.77,18.83 C2.1 | C2.1 2.92,18.83 6.58,18.83 U2.4 6.73,18.68 8.41,17 9.17,17 U2.1 | 5.66,9.84 6.43,9.84 U1.4 6.58,9.69 8.25,8.01 9.02,8.01 U1.1 | 5.66,9.84 2.77,9.84 C3.1 2.62,9.84 2.01,10.45 2.01,17.61 2.77,18.38 2.77,18.68 C2.1 | 5.66,9.84 5.66,4.97 9.17,1.46 10.08,1.46 11.3,2.68 12.06,2.68 J80.1
GND  (via drill 0.35)
  Top 0.152: AP2120N-3.0TRG1.1 11.61,41.39 11.61,39.1 12.06,38.65 R15.1 | 11.76,41.69 11.61,41.54 AP2120N-3.0TRG1.1 | 11.76,41.69 14.66,44.59 14.66,50.84 17.7,53.89 18.62,53.89 C11.1 | 5.82,57.39 6.73,57.39 S1.2 6.88,57.54 7.95,58.61 16.64,58.61 16.79,58.46 16.79,56.32 15.72,55.26 15.72,54.95 C10.1 | 5.82,57.39 3.38,57.39 | 3.38,57.39 2.77,57.39 S1.1 | 5.82,57.39 5.82,50.08 R13.1 5.97,49.92 9.63,46.27 9.63,43.83 11.76,41.69 | 3.38,57.39 3.38,53.89 3.68,53.58 3.68,50.08 C16.2 3.68,49.92 3.68,49.01 2.16,47.48 C15.1 2.01,47.33 2.01,45.05 C14.2 2.01,44.89 2.01,42.46 C13.1 2.01,42.3 2.01,39.86 C12.1 2.01,39.71 2.01,37.43 R7.1 2.16,37.27 2.16,34.38 8.56,27.98 8.86,27.98 U3.2 9.02,27.98 9.78,27.98 | 11.76,41.69 AP2120N-3.0TRG1.1 | 20.14,10.15 20.14,7.71 R2.1 19.99,7.56 15.57,3.14 13.44,3.14 | 20.14,10.15 20.45,10.45 C9.2 20.14,10.15 | 13.44,3.14 13.44,2.22 12.37,1.16 9.02,1.16 2.77,7.4 2.77,7.86 C3.2 | 13.44,3.14 12.67,3.9 10.69,3.9 9.63,2.83 J81.1 | 14.5,29.5 12.98,29.5 11.46,27.98 9.78,27.98 | 14.5,29.5 15.27,29.5 R5.1 | 5.21,27.06 2.62,27.06 C1.2 | 5.21,27.06 5.66,27.52 7.04,27.52 8.25,26.3 9.63,26.3 9.78,26.45 9.78,27.98 | 14.5,29.5 14.5,31.94 14.66,32.09 15.87,32.09 16.03,31.94 16.03,31.64 17.25,30.42 18.47,30.42 19.23,29.65 20.29,29.65 C8.2 20.26,29.44 v20.26,28.46 | 48.97,29.04 51.99,29.04 53.37,30.42 U$1.P$2 | 48.97,29.04 46.05,29.04 U$1.116 45.9,29.04 | R4.1 20.29,16.7 20.29,19.14 20.6,19.44 C7.2 20.75,19.6 | 5.36,17 2.92,17 C2.2 | 5.36,17 5.82,17.46 7.49,17.46 8.56,16.4 9.93,16.4 10.08,16.55 10.08,17.31 9.63,17.77 9.32,17.77 U2.2 9.17,17.92 8.86,17.92 5.21,21.58 5.21,23.88
  Top 0.152: 5.36,17 5.36,15.79 | 5.36,15.79 5.36,12.28 8.71,8.93 9.02,8.93 U1.2 9.17,8.93 11.61,8.93 14.05,11.37 18.62,11.37 19.84,10.15 20.14,10.15 | 5.36,15.79 19.08,15.79 19.84,16.55 20.14,16.55 R4.1 | 5.21,23.88 5.21,27.06 | R4.1 20.48,16.33 v20.48,14.26 | v48.89,27.22 48.89,28.97 48.97,29.04 | v20.88,25.5 19.25,23.88 5.21,23.88
  Bottom 0.152: v20.48,14.26 23.42,17.2 38.72,17.2 48.74,27.22 v48.89,27.22 | v20.26,28.46 20.26,26.12 v20.88,25.5
N$1
  Top 0.152: U1.3 9.17,9.84 11,9.84 11.61,10.45 L1.1
N$2
  Top 0.152: D1.C 5.66,37.27 3.84,37.27 R7.2
N$3
  Top 0.152: U2.3 9.32,18.83 10.85,20.36 L2.1
N$4  (via drill 0.35)
  Top 0.152: v3.68,43.52 3.68,42.46 C13.2 | U$1.74 56.11,38.19 56.11,38.95 55.96,39.1 v55.96,40.02 56.26,40.32 63.12,40.32 64.8,42 66.93,42 Y1.1
  Bottom 0.152: v3.68,43.52 3.68,47.03 4.6,47.94 18.47,47.94 23.65,42.76 53.21,42.76 v55.96,40.02
N$5
  Top 0.152: U3.3 9.02,28.89 10.54,30.42 L3.1
N$6  (via drill 0.35)
  Top 0.152: v6.12,39.71 3.84,39.71 C12.2 | v50.32,31.33 55.65,36.66 55.65,38.04 U$1.75 | v62.81,40.93 62.81,42.76 Y1.3
  Bottom 0.152: v6.12,39.71 10.08,39.71 22.58,27.22 25.02,27.22 29.13,31.33 v50.32,31.33 50.32,27.37 53.82,23.86 58.39,23.86 63.12,28.59 63.12,33.92 62.81,34.23 v62.81,40.93
N$7
  Top 0.152: C6.2 19.99,27.37 17.86,29.5 R6.1 17.7,29.5 17.25,29.96 | 17.25,29.96 16.03,31.18 15.27,31.18 R5.2 | 17.25,29.96 13.28,26 8.1,26 7.19,26.91 6.43,26.91 U3.5
N$8
  Top 0.152: R4.2 18.47,16.7 18.47,19.14 18.16,19.44 R3.1 18.01,19.6 15.57,19.6 C5.2 15.42,19.44 12.06,16.09 8.41,16.09 7.65,16.85 6.73,16.85 U2.5
N$9
  Top 0.152: R2.2 18.31,7.71 18.31,10.15 18.01,10.45 R1.1 17.86,10.6 15.42,10.6 C4.2 15.42,10.45 12.22,7.25 8.41,7.25 7.8,7.86 6.58,7.86 U1.5
N$10  (via drill 0.35)
  Top 0.152: 12.22,47.94 12.98,47.94 R11.2 | 12.22,47.94 10.54,47.94 R12.2 10.39,47.94 9.63,48.7 9.63,52.36 13.44,56.17 13.44,57.24 Y2.P$1 | 12.22,47.94 12.22,48.55 | 12.22,48.55 12.22,52.06 13.89,53.73 13.89,54.8 C10.2 | R10.2 15.57,47.94 18.01,47.94 R9.2 18.16,47.94 20.6,47.94 R8.2 20.75,47.79 v21.82,47.79 | v38.89,47.79 47.73,38.95 47.73,38.19 U$1.95 | v11.91,48.55 12.22,48.55
  Bottom 0.152: v38.89,47.79 v21.82,47.79 21.06,48.55 v11.91,48.55
N$11  (via drill 0.35)
  Top 0.152: 14.81,56.17 14.96,56.17 16.03,57.24 Y2.P$2 | 14.81,56.17 13.89,56.17 10.54,52.82 10.54,49.62 R12.1 | 13.13,50.69 13.13,52.51 14.81,54.19 14.81,56.17 | 13.13,50.69 13.13,49.62 R11.1 | 19.38,49.62 18.16,49.62 R9.1 18.01,49.62 15.57,49.62 R10.1 15.42,49.62 v15.42,50.69 | 19.38,49.62 20.6,49.62 R8.1 | 19.38,49.62 19.38,54.8 18.62,55.56 C11.2 18.62,55.71 23.34,60.44 24.56,60.44 25.32,59.68 25.32,59.07 46.2,38.19 47.27,38.19 U$1.96 | v13.74,50.69 13.13,50.69
  Bottom 0.152: v15.42,50.69 v13.74,50.69
RESET  (via drill 0.35)
  Top 0.152: C16.1 2.16,50.08 2.16,54.04 2.46,54.34 R16.1 2.46,54.5 2.46,56.17 1.85,56.78 1.85,58.15 2.62,58.91 S1.4 2.77,59.07 6.73,59.07 S1.3 6.88,58.91 16.79,58.91 v17.4,58.31 | U$1.99 44.99,35.87 26.73,54.13 v26.73,55.45
  Bottom 0.152: v26.73,55.45 20.26,55.45 v17.4,58.31
SVREF  (via drill 0.35)
  Top 0.152: v57.48,39.41 57.33,39.26 57.33,38.19 U$1.71 | v61.59,37.43 62.2,36.82 62.2,36.51 61.9,36.21 61.14,36.21 U$1.63 | 12.98,36.82 11.46,36.82 11.15,36.51 7.04,36.51 6.73,36.82 6.73,41.39 3.84,44.28 3.84,44.89 C14.1 | 12.98,36.82 13.74,36.05 R14.1 | 12.98,36.82 13.74,37.58 13.74,38.49 R15.2 13.89,38.65 15.42,40.17 v20.29,40.17
  Bottom 0.152: v61.59,37.43 59.61,39.41 v57.48,39.41 25.32,39.41 24.56,40.17 v20.29,40.17
U$1_EPHY_LINK_LED
  Top 0.152: U$1.77 54.89,38.19 54.89,54.19 60.07,59.37 J4.1
U$1_EPHY_RTX
  Top 0.152: J10.1 37.78,48.4 39.14,48.4 48.05,39.49 48.05,38.12 U$1.94
U$1_EPHY_RXN
  Top 0.152: U$1.89 50.16,38.19 50.16,46.11 37.06,59.22 J6.1
U$1_EPHY_RXP
  Top 0.152: U$1.90 49.71,38.19 49.71,43.98 34.47,59.22 J7.1
U$1_EPHY_SPD_LED
  Top 0.152: U$1.78 54.5,56.21 J5.1
U$1_EPHY_TXN
  Top 0.152: U$1.91 49.3,41.94 J8.1
U$1_EPHY_TXP
  Top 0.152: U$1.92 48.95,38.19 48.95,39.71 29.44,59.22 J9.1
U$1_HBIAS  (via drill 0.35)
  Top 0.152: v47.27,27.83 46.05,27.83 U$1.119
  Bottom 0.152: v47.27,27.83 26.09,27.83 24.26,26 J24.1
U$1_HPCOM  (via drill 0.35)
  Top 0.152: J16.1 24.41,11 v26.2,11 | v29.15,15.39 39.22,25.47 U$1.125
  Bottom 0.152: v26.2,11 26.2,12.45 v29.15,15.39
U$1_HPCOMFB
  Top 0.152: U$1.124 45.9,25.84 36.75,25.84 24.26,13.35 J15.1
U$1_HPOUTL
  Top 0.152: U$1.121 30.35,27.06 24.26,20.97 J12.1
U$1_HPOUTR
  Top 0.152: U$1.120 45.9,27.52 28.22,27.52 24.26,23.56 J11.1
U$1_HPVCCBP
  Top 0.152: U$1.123 45.9,26.3 34.62,26.3 24.26,15.94 J14.1
U$1_HPVCCIN  (via drill 0.35)
  Top 0.152: v47.27,26.61 46.05,26.61 U$1.122
  Bottom 0.152: v47.27,26.61 32.49,26.61 24.26,18.38 J13.1
U$1_MCSI-CKN
  Top 0.152: J21.1 50.93,47.94 50.93,38.19 U$1.87
U$1_MCSI-CKP
  Top 0.152: U$1.86 51.3,50.1 J22.1
U$1_MCSI-D0N
  Top 0.152: U$1.82 52.91,38.19 52.91,59.07 52.6,59.37 J18.1
U$1_MCSI-D0P
  Top 0.152: U$1.81 53.37,38.19 53.37,57.7 55.04,59.37 J17.1
U$1_MCSI-D1N
  Top 0.152: U$1.84 52.15,38.19 52.15,54.8 47.57,59.37 J20.1
U$1_MCSI-D1P
  Top 0.152: U$1.83 52.5,56.92 J19.1
U$1_MICIN1N
  Top 0.152: U$1.114 45.9,29.81 28.52,29.81 24.56,33.77 24.1,33.77 J27.1
U$1_MICIN1P
  Top 0.152: J28.1 30.2,30.26 U$1.113
U$1_PB0/UART2/TX
  Top 0.152: U$1.39 61.14,26.61 74.09,26.61 82.47,18.22 J66.1
U$1_PB1/UART2/RX
  Top 0.152: U$1.40 61.14,27.06 76.07,27.06 82.47,20.66 J67.1
U$1_PB2  (via drill 0.35)
  Top 0.152: v59.77,27.52 60.99,27.52 U$1.41 | v51.08,25.69 v52.91,27.52
  Bottom 0.152: v52.91,27.52 v59.77,27.52 | v51.08,25.69 51.54,25.69 53.97,23.25 82.47,23.25 J68.1
U$1_PB3
  Top 0.152: U$1.42 61.14,27.83 80.49,27.83 82.47,25.84 J69.1
U$1_PB4/PWM0
  Top 0.152: U$1.43 61.14,28.28 82.44,28.28 J70.1
U$1_PB5/PWM1
  Top 0.152: U$1.44 80.05,28.67 J71.1
U$1_PB6/I2C0/SCL
  Top 0.152: U$1.45 61.16,29.12 77.96,29.12 J72.1
U$1_PB7/I2C0/SDA
  Top 0.152: J73.1 75.81,29.5 61.14,29.5 U$1.46
U$1_PB8/I2C1/SCL
  Top 0.152: U$1.48 61.14,30.26 74.02,30.26 82.47,38.72 J74.1
U$1_PB9/I2C1/SDA
  Top 0.152: U$1.49 61.14,30.72 71.87,30.72 82.39,41.24 J75.1
U$1_PC0/SPI1/MISO
  Top 0.152: U$1.52 70.55,31.87 J76.1
U$1_PC1/SPI1/SCK
  Top 0.152: U$1.53 60.99,32.24 59.61,32.24 58.39,33.46 58.39,35.29 62.05,38.95 65.68,35.32 82.31,51.96 J77.1
U$1_PC2/SPI1/CS
  Top 0.152: U$1.54 68.49,32.68 J78.1
U$1_PC3/SPI1/MOSI
  Top 0.152: U$1.55 61.1,33.05 61.15,33.01 66.09,33.01 82.37,49.29 J79.1
U$1_PE0/CSI-CLK-/LCD-CLK
  Top 0.152: U$1.37 61.14,25.84 72.26,25.84 82.47,15.63 J1.1
U$1_PE1/CSI-MCLK/LCD-DE
  Top 0.152: U$1.36 70.18,25.47 J29.1
U$1_PE2/CSI-HSYNC/LCD-HSYNC
  Top 0.152: U$1.35 61.14,25.08 68,25.08 82.47,10.6 J30.1
U$1_PE3/CSI-VSYNC/LCD-VSYNC
  Top 0.152: U$1.34 61.14,24.62 65.86,24.62 82.47,8.01 J31.1
U$1_PE4/CSI-D0/LCD-D2
  Top 0.152: U$1.33 61.14,24.17 63.73,24.17 82.47,5.42 J32.1
U$1_PE5/CSI-D1/-LCD-D3
  Top 0.152: U$1.32 59.77,22.8 60.83,22.8 79.73,3.9 81.25,3.9 82.47,2.68 J33.1
U$1_PE6/CSI-D2/LCD-D4
  Top 0.152: U$1.31 59.31,22.8 59.31,22.03 77.44,3.9 78.66,3.9 79.88,2.68 J34.1
U$1_PE7/CSI-D3/LCD-D5
  Top 0.152: U$1.30 58.85,22.8 58.85,21.27 77.44,2.68 J35.1
U$1_PE8/CSI-D4/LCD-D6
  Top 0.152: U$1.28 58.09,22.8 58.09,19.44 74.85,2.68 J36.1
U$1_PE9/CSI-D5/LCD-D7
  Top 0.152: U$1.27 57.7,17.28 J37.1
U$1_PE10/CSI-D6/LCD-D10
  Top 0.152: U$1.24 56.57,22.8 56.57,15.94 69.82,2.68 J38.1
U$1_PE11/CSI-D7/LCD-D11
  Top 0.152: U$1.23 56.11,22.8 56.11,13.8 67.23,2.68 J39.1
U$1_PE12/CSI-D8/LCD-D12
  Top 0.152: U$1.22 55.65,22.8 55.65,11.67 64.64,2.68 J40.1
U$1_PE13/CSI-D9/LCD-D13
  Top 0.152: U$1.18 54.13,22.8 54.13,10.76 62.2,2.68 J41.1
U$1_PE14/CSI-D10/LCD-D14
  Top 0.152: U$1.17 53.7,8.58 J47.1
U$1_PE15/CSI-D11/LCD-D15
  Top 0.152: U$1.16 53.37,22.8 53.37,6.34 57.02,2.68 J46.1
U$1_PE16/CSI-D12/LCD-D18
  Top 0.152: U$1.15 52.91,22.8 52.91,4.36 54.58,2.68 J45.1
U$1_PE17/CSI-D13/LCD-D19
  Top 0.152: U$1.14 52.5,3.15 J44.1
U$1_PE18/CSI-D14/LCD-D20
  Top 0.152: U$1.13 52.15,22.8 52.15,5.27 49.56,2.68 J43.1
U$1_PE19/CSI-D15/LCD-D21
  Top 0.152: U$1.11 51.3,7.03 J42.1
U$1_PE20/CSI-FIELD/CSI-MIPI-M-CLK
  Top 0.152: U$1.10 50.93,22.8 50.93,9.08 44.53,2.68 J52.1
U$1_PE21/UART1/TX  (via drill 0.35)
  Top 0.152: v50.47,24.32 50.47,22.95 U$1.9
  Bottom 0.152: v50.47,24.32 50.47,11.21 41.94,2.68 J51.1
U$1_PE22/UART1/RX
  Top 0.152: U$1.8 50.16,22.8 50.16,13.5 39.34,2.68 J50.1
U$1_PE23/LCD-D22/
  Top 0.152: U$1.7 49.71,22.8 49.71,15.48 36.91,2.68 J49.1
U$1_PE24/LCD-D23  (via drill 0.35)
  Top 0.152: v49.25,24.32 49.25,22.95 U$1.6
  Bottom 0.152: v49.25,24.32 49.25,17.61 34.32,2.68 J48.1
U$1_PF0/SDC0/D1  (via drill 0.35)
  Top 0.152: v47.27,33.01 46.96,32.7 46.05,32.7 U$1.107 | J59.1 v35.23,32.85
  Bottom 0.152: v47.27,33.01 35.38,33.01 v35.23,32.85
U$1_PF1/SDC0/D0
  Top 0.152: U$1.106 45.9,33.01 37.52,33.01 24.1,46.42 J60.1
U$1_PF2/SDC0/CLK
  Top 0.152: U$1.105 39.95,33.46 24.41,49.01 24.1,49.01 J61.1
U$1_PF3/SDC0/CMD
  Top 0.152: J62.1 41.48,34.23 45.9,34.23 U$1.103
U$1_PF4/SDC0/D3
  Top 0.152: U$1.102 45.9,34.68 42.7,34.68 24.1,53.28 24.1,54.04 J63.1
U$1_PF5/SDC0/D2
  Top 0.152: J64.1 25.02,55.77 25.02,54.98 44.93,35.07 U$1.101
U$1_PF6
  Top 0.152: J65.1 25.32,58 25.32,55.1 44.97,35.46 U$1.100
U$1_PG0/SDC1/CLK
  Top 0.152: U$1.5 48.95,22.8 48.95,19.9 31.72,2.68 J53.1
U$1_PG1/SDC1/CMD
  Top 0.152: U$1.4 48.49,22.8 48.49,21.88 29.35,2.74 29.29,2.74 29.29,2.68 J54.1
U$1_PG2/SDC1/D0
  Top 0.152: U$1.3 48.05,22.82 48.05,21.93 46.63,20.51 42.37,20.51 26.63,4.78 J55.1
U$1_PG3/SDC1/D1
  Top 0.152: U$1.2 47.73,22.8 47.73,22.03 46.51,20.81 42.24,20.81 24.1,2.68 J56.1
U$1_PG4/SDC1/D2
  Top 0.152: U$1.1 47.27,22.8 41.33,22.8 24.26,5.73 J57.1
U$1_PG5/SDC1/D3
  Top 0.152: U$1.128 45.9,24.17 40.56,24.17 24.71,8.32 24.26,8.32 J58.1
U$1_RTC-VIO  (via drill 0.35)
  Top 0.152: v4.9,47.33 3.84,47.33 C15.2 | v44.98,37.58 U$1.97
  Bottom 0.152: v4.9,47.33 12.22,47.33 21.97,37.58 v44.98,37.58
U$1_SZQ  (via drill 0.35)
  Top 0.152: v11.61,44.74 7.65,48.7 7.65,49.92 R13.2 | v51.84,31.94 51.84,32.4 56.57,37.12 56.57,38.04 U$1.73
  Bottom 0.152: v11.61,44.74 11.61,38.65 20.45,29.81 27.18,29.81 29.01,31.64 29.68,31.64 29.98,31.94 v51.84,31.94
U$1_USB-DM
  Top 0.152: U$1.110 45.9,31.48 34.01,31.48 24.1,41.39 J2.1
U$1_USB-DP
  Top 0.152: U$1.111 45.9,31.03 31.88,31.03 24.1,38.8 J3.1
U$1_VCC-MCSI
  Top 0.152: U$1.85 51.69,38.19 51.69,52.67 44.98,59.37 J23.1
U$1_VRA1
  Top 0.152: U$1.117 26.55,28.67 J26.1
U$1_VRA2
  Top 0.152: U$1.118 45.9,28.28 24.41,28.28 24.26,28.43 J25.1

### Text on the board
tPlace: RESET | Tiger Lily v0.2 / www.zerogravityantfarm.com | GND | +5v
200bmp: C:/Users/mcfly/Downloads/tiger-lily-arum-lily-flower-flower-bouquet-png-clip-art-thumbnail.bmp